# Altium schematic sheet H3_eMMC.SchDoc
size A3
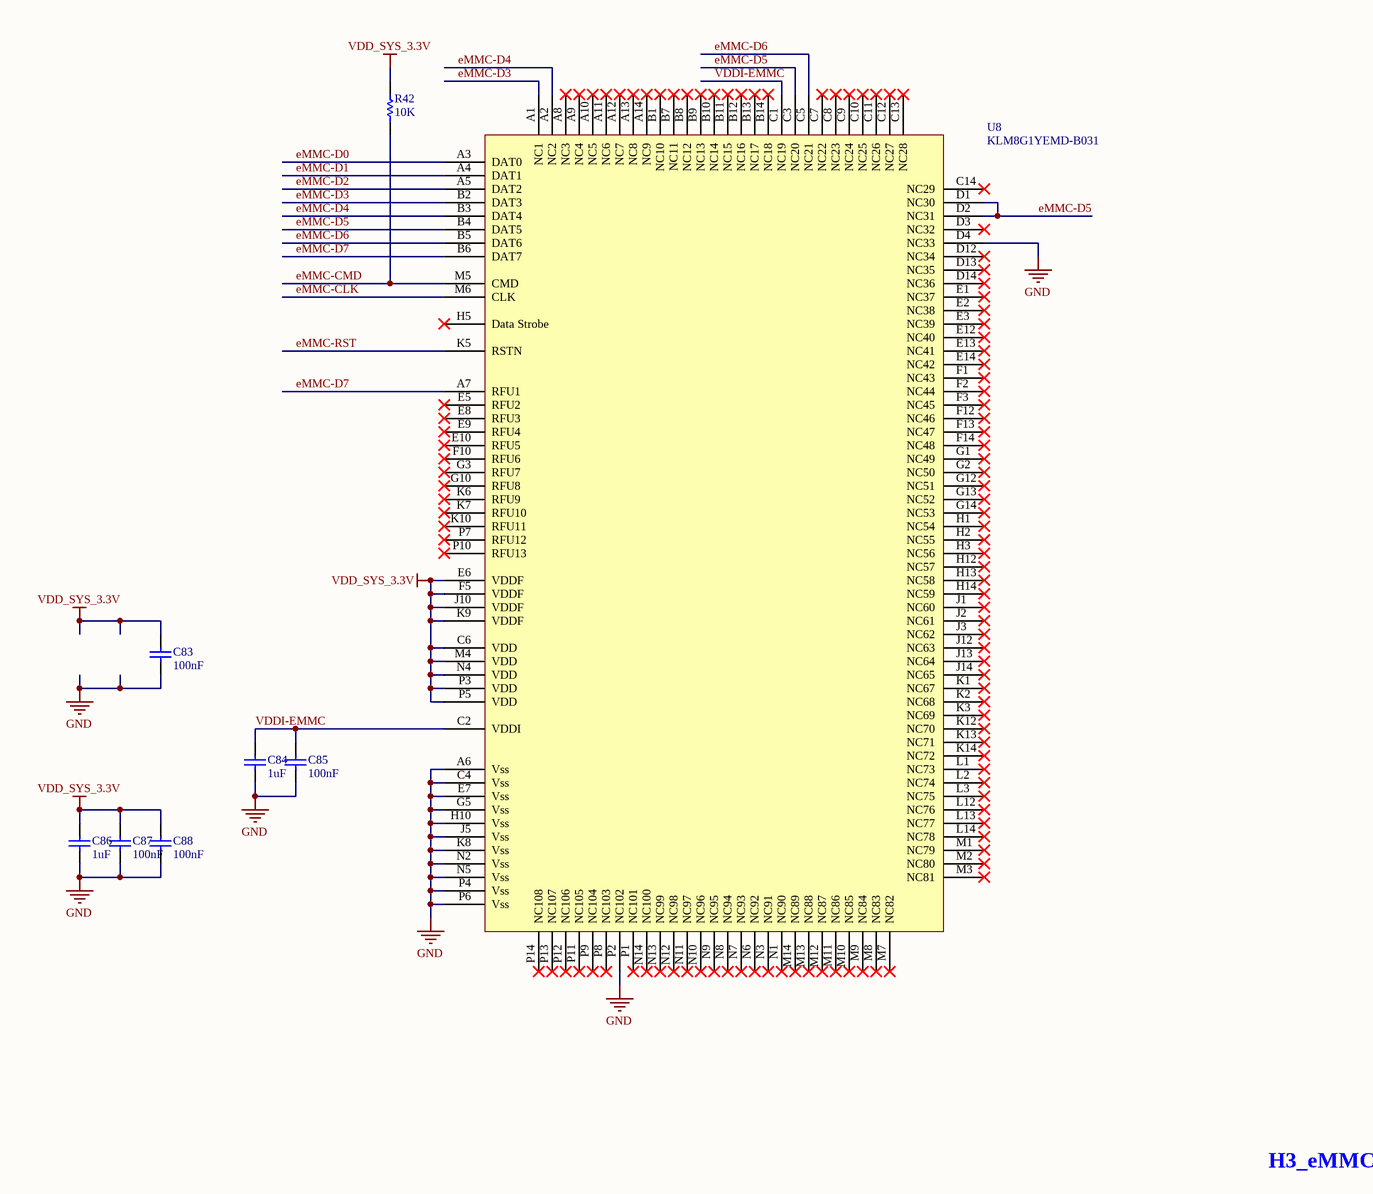
[diagram p0: H3_eMMC.SchDoc]

## Parts
C83  100nF  [C0402]
C84  1uF  [C0402]
C85  100nF  [C0402]
C86  1uF  [C0402]
C87  100nF  [C0402]
C88  100nF  [C0402]
R42  10K  [R0402]
U8  KLM8G1YEMD-B031  [FBGA153]

## Nets
GND: C83.1 C84.1 C85.1 C86.1 C87.1 C88.1 U8.A6(Vss) U8.C4(Vss) U8.D4(NC33) U8.E7(Vss) U8.G5(Vss) U8.H10(Vss) U8.J5(Vss) U8.K8(Vss) U8.N2(Vss) U8.N5(Vss) U8.P2(NC102) U8.P4(Vss) U8.P6(Vss)
VDD_SYS_3.3V: C83.2 C86.2 C87.2 C88.2 R42.2 U8.C6(VDD) U8.E6(VDDF) U8.F5(VDDF) U8.J10(VDDF) U8.K9(VDDF) U8.M4(VDD) U8.N4(VDD) U8.P3(VDD) U8.P5(VDD)
eMMC-CLK: U8.M6(CLK)
eMMC-CMD: R42.1 U8.M5(CMD)
eMMC-D0: U8.A3(DAT0)
eMMC-D1: U8.A4(DAT1)
eMMC-D2: U8.A5(DAT2)
eMMC-D3: U8.A1(NC1) U8.B2(DAT3)
eMMC-D4: U8.A2(NC2) U8.B3(DAT4)
eMMC-D5: U8.B4(DAT5) U8.C3(NC20) U8.D1(NC30) U8.D2(NC31)
eMMC-D6: U8.B5(DAT6) U8.C5(NC21)
eMMC-D7: U8.A7(RFU1) U8.B6(DAT7)
eMMC-RST: U8.K5(RSTN)
VDDI-EMMC: C84.2 C85.2 U8.C1(NC19) U8.C2(VDDI)

Not connected (* = marked no-connect by the designer): U8 A8(NC3)* A9(NC4)* A10(NC5)* A11(NC6)* A12(NC7)* A13(NC8)* A14(NC9)* B1(NC10)* B7(NC11)* B8(NC12)* B9(NC13)* B10(NC14)* B11(NC15)* B12(NC16)* B13(NC17)* B14(NC18)* C7(NC22)* C8(NC23)* C9(NC24)* C10(NC25)* C11(NC26)* C12(NC27)* C13(NC28)* C14(NC29)* D3(NC32)* D12(NC34)* D13(NC35)* D14(NC36)* E1(NC37)* E2(NC38)* E3(NC39)* E5(RFU2)* E8(RFU3)* E9(RFU4)* E10(RFU5)* E12(NC40)* E13(NC41)* E14(NC42)* F1(NC43)* F2(NC44)* F3(NC45)* F10(RFU6)* F12(NC46)* F13(NC47)* F14(NC48)* G1(NC49)* G2(NC50)* G3(RFU7)* G10(RFU8)* G12(NC51)* G13(NC52)* G14(NC53)* H1(NC54)* H2(NC55)* H3(NC56)* H5(Data_Strobe)* H12(NC57)* H13(NC58)* H14(NC59)* J1(NC60)* J2(NC61)* J3(NC62)* J12(NC63)* J13(NC64)* J14(NC65)* K1(NC67)* K2(NC68)* K3(NC69)* K6(RFU9)* K7(RFU10)* K10(RFU11)* K12(NC70)* K13(NC71)* K14(NC72)* L1(NC73)* L2(NC74)* L3(NC75)* L12(NC76)* L13(NC77)* L14(NC78)* M1(NC79)* M2(NC80)* M3(NC81)* M7(NC82)* M8(NC83)* M9(NC84)* M10(NC85)* M11(NC86)* M12(NC87)* M13(NC88)* M14(NC89)* N1(NC90)* N3(NC91)* N6(NC92)* N7(NC93)* N8(NC94)* N9(NC95)* N10(NC96)* N11(NC97)* N12(NC98)* N13(NC99)* N14(NC100)* P1(NC101)* P7(RFU12)* P8(NC103)* P9(NC104)* P10(RFU13)* P11(NC105)* P12(NC106)* P13(NC107)* P14(NC108)*

## Notes on the sheet
- H3_eMMC

## Library data of the parts
C83-C88 = C0402: 电容; Published: 8-Jun-2000; LatestRevisionDate: 17-Jul-2002; LatestRevisionNote: Re-released for DXP Platform.; PackageReference: RAD-0.3; Publisher: Altium Limited; PackageDescription: Radial Cap, Thru-Hole; 2 Leads; 0.3 in Pin Spacing; UnitPrice: 0.02
R42 = RES0402: 电阻; Published: 8-Jun-2000; LatestRevisionDate: 17-Jul-2002; LatestRevisionNote: Re-released for DXP Platform.; PackageReference: AXIAL-0.3; Publisher: Altium Limited; PackageDescription: Axial Device, Thru-Hole; 2 Leads; 0.3 in Pin Spacing